# Altium schematic sheet INC-FBTMC429-V1.SchDoc
size A3
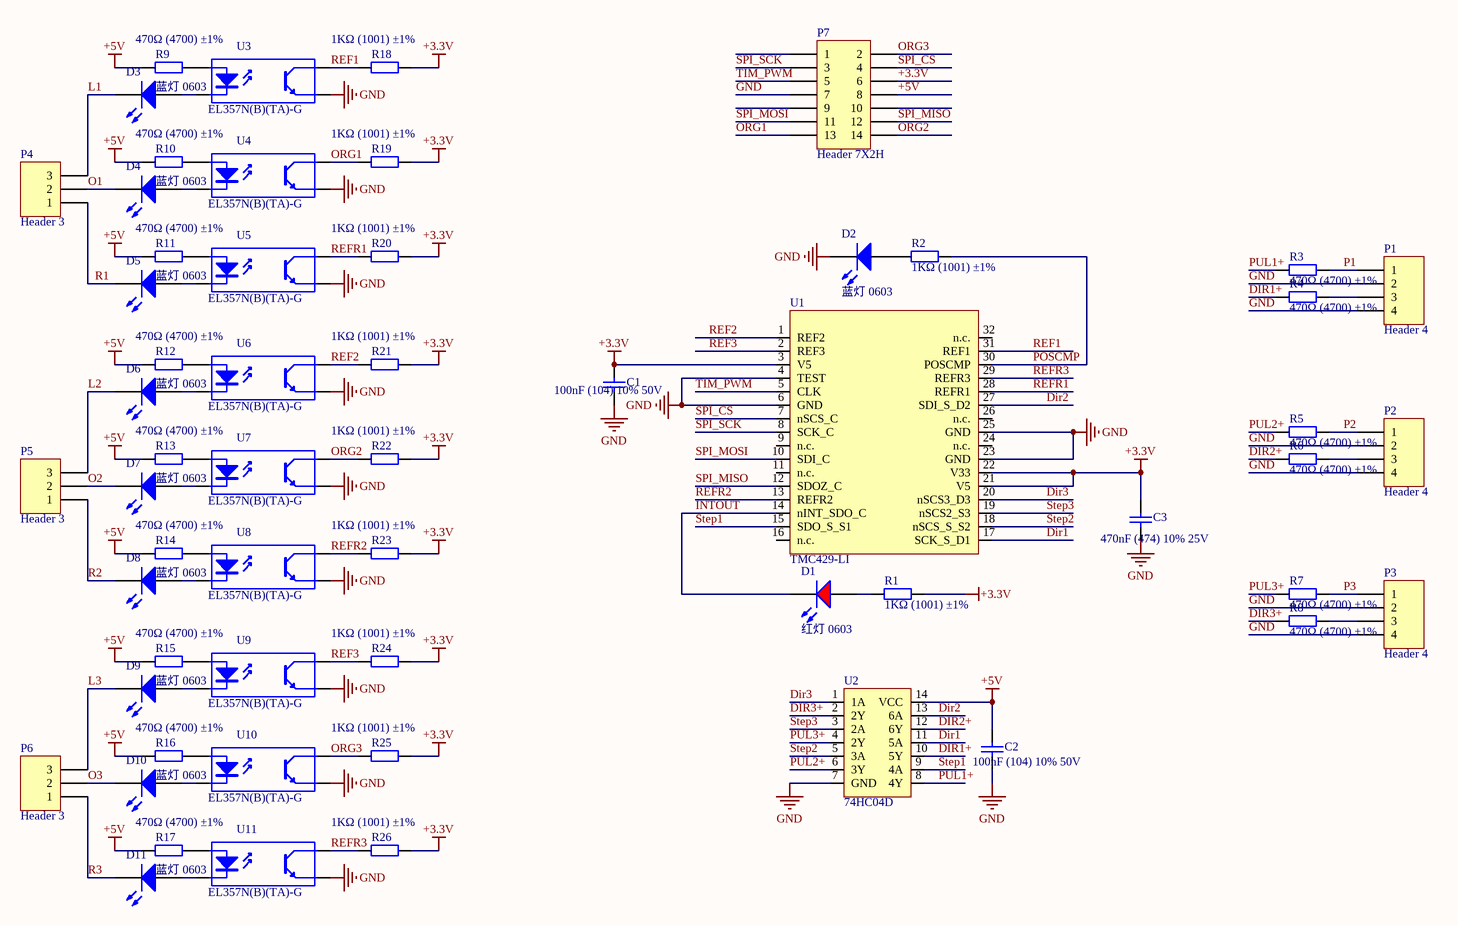
[diagram p0: INC-FBTMC429-V1.SchDoc]

## Parts
C1  100nF (104) 10% 50V  [0603_C]
C2  100nF (104) 10% 50V  [0603_C]
C3  470nF (474) 10% 25V  [0603_C]
D1  红灯 0603  [0603_LED_S1]
D2  蓝灯 0603  [0603_LED_S1]
D3  蓝灯 0603  [0603_LED_S1]
D4  蓝灯 0603  [0603_LED_S1]
D5  蓝灯 0603  [0603_LED_S1]
D6  蓝灯 0603  [0603_LED_S1]
D7  蓝灯 0603  [0603_LED_S1]
D8  蓝灯 0603  [0603_LED_S1]
D9  蓝灯 0603  [0603_LED_S1]
D10  蓝灯 0603  [0603_LED_S1]
D11  蓝灯 0603  [0603_LED_S1]
P1  Header 4  [WJ15EDGVC-3.81-4P]
P2  Header 4  [WJ15EDGVC-3.81-4P]
P3  Header 4  [WJ15EDGVC-3.81-4P]
P4  Header 3  [WJ15EDGVC-3.81-3P]
P5  Header 3  [WJ15EDGVC-3.81-3P]
P6  Header 3  [WJ15EDGVC-3.81-3P]
P7  Header 7X2H  [直牛角连接器 2*7*2.54]
R1  1KΩ (1001) ±1%  [0603_R]
R2  1KΩ (1001) ±1%  [0603_R]
R3  470Ω (4700) ±1%  [0603_R]
R4  470Ω (4700) ±1%  [0603_R]
R5  470Ω (4700) ±1%  [0603_R]
R6  470Ω (4700) ±1%  [0603_R]
R7  470Ω (4700) ±1%  [0603_R]
R8  470Ω (4700) ±1%  [0603_R]
R9  470Ω (4700) ±1%  [0603_R]
R10  470Ω (4700) ±1%  [0603_R]
R11  470Ω (4700) ±1%  [0603_R]
R12  470Ω (4700) ±1%  [0603_R]
R13  470Ω (4700) ±1%  [0603_R]
R14  470Ω (4700) ±1%  [0603_R]
R15  470Ω (4700) ±1%  [0603_R]
R16  470Ω (4700) ±1%  [0603_R]
R17  470Ω (4700) ±1%  [0603_R]
R18  1KΩ (1001) ±1%  [0603_R]
R19  1KΩ (1001) ±1%  [0603_R]
R20  1KΩ (1001) ±1%  [0603_R]
R21  1KΩ (1001) ±1%  [0603_R]
R22  1KΩ (1001) ±1%  [0603_R]
R23  1KΩ (1001) ±1%  [0603_R]
R24  1KΩ (1001) ±1%  [0603_R]
R25  1KΩ (1001) ±1%  [0603_R]
R26  1KΩ (1001) ±1%  [0603_R]
U1  TMC429-LI  [QFN-32_5x5x05P]
U2  74HC04D  [SOIC-14_150mil]
U3  EL357N(B)(TA)-G  [SOP-4_P2.54]
U4  EL357N(B)(TA)-G  [SOP-4_P2.54]
U5  EL357N(B)(TA)-G  [SOP-4_P2.54]
U6  EL357N(B)(TA)-G  [SOP-4_P2.54]
U7  EL357N(B)(TA)-G  [SOP-4_P2.54]
U8  EL357N(B)(TA)-G  [SOP-4_P2.54]
U9  EL357N(B)(TA)-G  [SOP-4_P2.54]
U10  EL357N(B)(TA)-G  [SOP-4_P2.54]
U11  EL357N(B)(TA)-G  [SOP-4_P2.54]

## Nets
+3.3V: C1.2 C3.2 P7.6 R1.2 R18.1 R19.1 R20.1 R21.1 R22.1 R23.1 R24.1 R25.1 R26.1 U1.3(V5) U1.21(V5) U1.22(V33)
+5V: C2.1 P7.8 R9.1 R10.1 R11.1 R12.1 R13.1 R14.1 R15.1 R16.1 R17.1 U2.14(VCC)
GND: C1.1 C2.2 C3.1 D2.K P1.2 P1.4 P2.2 P2.4 P3.2 P3.4 P7.7 U1.4(TEST) U1.6(GND) U1.23(GND) U1.25(GND) U2.7(GND) U3.3(E) U4.3(E) U5.3(E) U6.3(E) U7.3(E) U8.3(E) U9.3(E) U10.3(E) U11.3(E)
Dir1: U1.17(SCK_S_D1) U2.11(5A)
DIR1+: R4.1 U2.10(5Y)
Dir2: U1.27(SDI_S_D2) U2.13(6A)
DIR2+: R6.1 U2.12(6Y)
Dir3: U1.20(nSCS3_D3) U2.1(1A)
DIR3+: R8.1 U2.2(2Y)
INTOUT: D1.K U1.14(nINT_SDO_C)
L1: D3.K P4.3
L2: D6.K P5.3
L3: D9.K P6.3
O1: D4.K P4.2
O2: D7.K P5.2
O3: D10.K P6.2
ORG1: P7.13 R19.2 U4.4(C)
ORG2: P7.14 R22.2 U7.4(C)
ORG3: P7.2 R25.2 U10.4(C)
P1: P1.1 R3.2
P2: P2.1 R5.2
P3: P3.1 R7.2
POSCMP: R2.2 U1.30(POSCMP)
PUL1+: R3.1 U2.8(4Y)
PUL2+: R5.1 U2.6(3Y)
PUL3+: R7.1 U2.4(2Y)
R1: D5.K P4.1
R2: D8.K P5.1
R3: D11.K P6.1
REF1: R18.2 U1.31(REF1) U3.4(C)
REF2: R21.2 U1.1(REF2) U6.4(C)
REF3: R24.2 U1.2(REF3) U9.4(C)
REFR1: R20.2 U1.28(REFR1) U5.4(C)
REFR2: R23.2 U1.13(REFR2) U8.4(C)
REFR3: R26.2 U1.29(REFR3) U11.4(C)
SPI_CS: P7.4 U1.7(nSCS_C)
SPI_MISO: P7.12 U1.12(SDOZ_C)
SPI_MOSI: P7.11 U1.10(SDI_C)
SPI_SCK: P7.3 U1.8(SCK_C)
Step1: U1.15(SDO_S_S1) U2.9(4A)
Step2: U1.18(nSCS_S_S2) U2.5(3A)
Step3: U1.19(nSCS2_S3) U2.3(2A)
TIM_PWM: P7.5 U1.5(CLK)
NetD1_A: D1.A R1.1
NetD2_A: D2.A R2.1
NetD3_A: D3.A U3.2(K)
NetD4_A: D4.A U4.2(K)
NetD5_A: D5.A U5.2(K)
NetD6_A: D6.A U6.2(K)
NetD7_A: D7.A U7.2(K)
NetD8_A: D8.A U8.2(K)
NetD9_A: D9.A U9.2(K)
NetD10_A: D10.A U10.2(K)
NetD11_A: D11.A U11.2(K)
NetP1_3: P1.3 R4.2
NetP2_3: P2.3 R6.2
NetP3_3: P3.3 R8.2
NetR9_2: R9.2 U3.1(A)
NetR10_2: R10.2 U4.1(A)
NetR11_2: R11.2 U5.1(A)
NetR12_2: R12.2 U6.1(A)
NetR13_2: R13.2 U7.1(A)
NetR14_2: R14.2 U8.1(A)
NetR15_2: R15.2 U9.1(A)
NetR16_2: R16.2 U10.1(A)
NetR17_2: R17.2 U11.1(A)

Not connected (* = marked no-connect by the designer): P7 1 9 10; U1 9(n.c.) 11(n.c.) 16(n.c.) 24(n.c.) 26(n.c.) 32(n.c.)

## Library data of the parts
C1 C2 = 0603 100nF (104) 10% 50V: 贴片电容; ComponentLink1Description: 供应商链接; ComponentLink1URL: http://www.szlcsc.com/product/details_15331.html; Package: 0603; Supplier: LC; SuppliersPartNumber: C14663
C3 = 0603 470nF (474) 10% 25V: 贴片电容; ComponentLink1Description: 供应商链接; ComponentLink1URL: http://www.szlcsc.com/product/details_1975.html; Package: 0603; Supplier: LC; SuppliersPartNumber: C1623
D1 = 0603 红灯: 发光二极管; ComponentLink1Description: 供应商链接; ComponentLink1URL: http://www.szlcsc.com/product/details_2659.html; Package: 0603; Supplier: LC; SuppliersPartNumber: C2286
D2-D11 = 0603 蓝灯: 发光二极管; ComponentLink1Description: 供应商链接; ComponentLink1URL: http://www.szlcsc.com/product/details_73150.html; Package: 0603; Supplier: LC; SuppliersPartNumber: C72041
P1-P3 = Header 4: Header, 4-Pin; LatestRevisionDate: 17-Jul-2002; LatestRevisionNote: Re-released for DXP Platform.; Publisher: Altium Limited
P4-P6 = Header 3: Header, 3-Pin; LatestRevisionDate: 17-Jul-2002; LatestRevisionNote: Re-released for DXP Platform.; Publisher: Altium Limited
P7 = Header 7X2H: Header, 7-Pin, Dual row, Right Angle; LatestRevisionDate: 17-Jul-2002; LatestRevisionNote: Re-released for DXP Platform.; Publisher: Altium Limited
R1 R2 R18-R26 = 0603 1KΩ (1001) 1%: 贴片电阻; ComponentLink1Description: 供应商链接; ComponentLink1URL: http://www.szlcsc.com/product/details_21904.html; Package: 0603; Supplier: LC; SuppliersPartNumber: C21190
R3-R17 = 0603 470Ω (4700) 1%: 贴片电阻; ComponentLink1Description: 供应商链接; ComponentLink1URL: http://www.szlcsc.com/product/details_23906.html; Package: 0603; Supplier: LC; SuppliersPartNumber: C23179
U2 = 74HC04
U3-U11 = EL357N(B)(TA)-G: 贴片光耦; ComponentLink1Description: 供应商链接; ComponentLink1URL: http://www.szlcsc.com/product/details_7114.html; Package: SOP-4_P2.54; Supplier: LC; SuppliersPartNumber: C6649